# Altium schematic sheet Top.SchDoc
size 420 x 297 mm; SheetNumber: 1; SheetTotal: 13
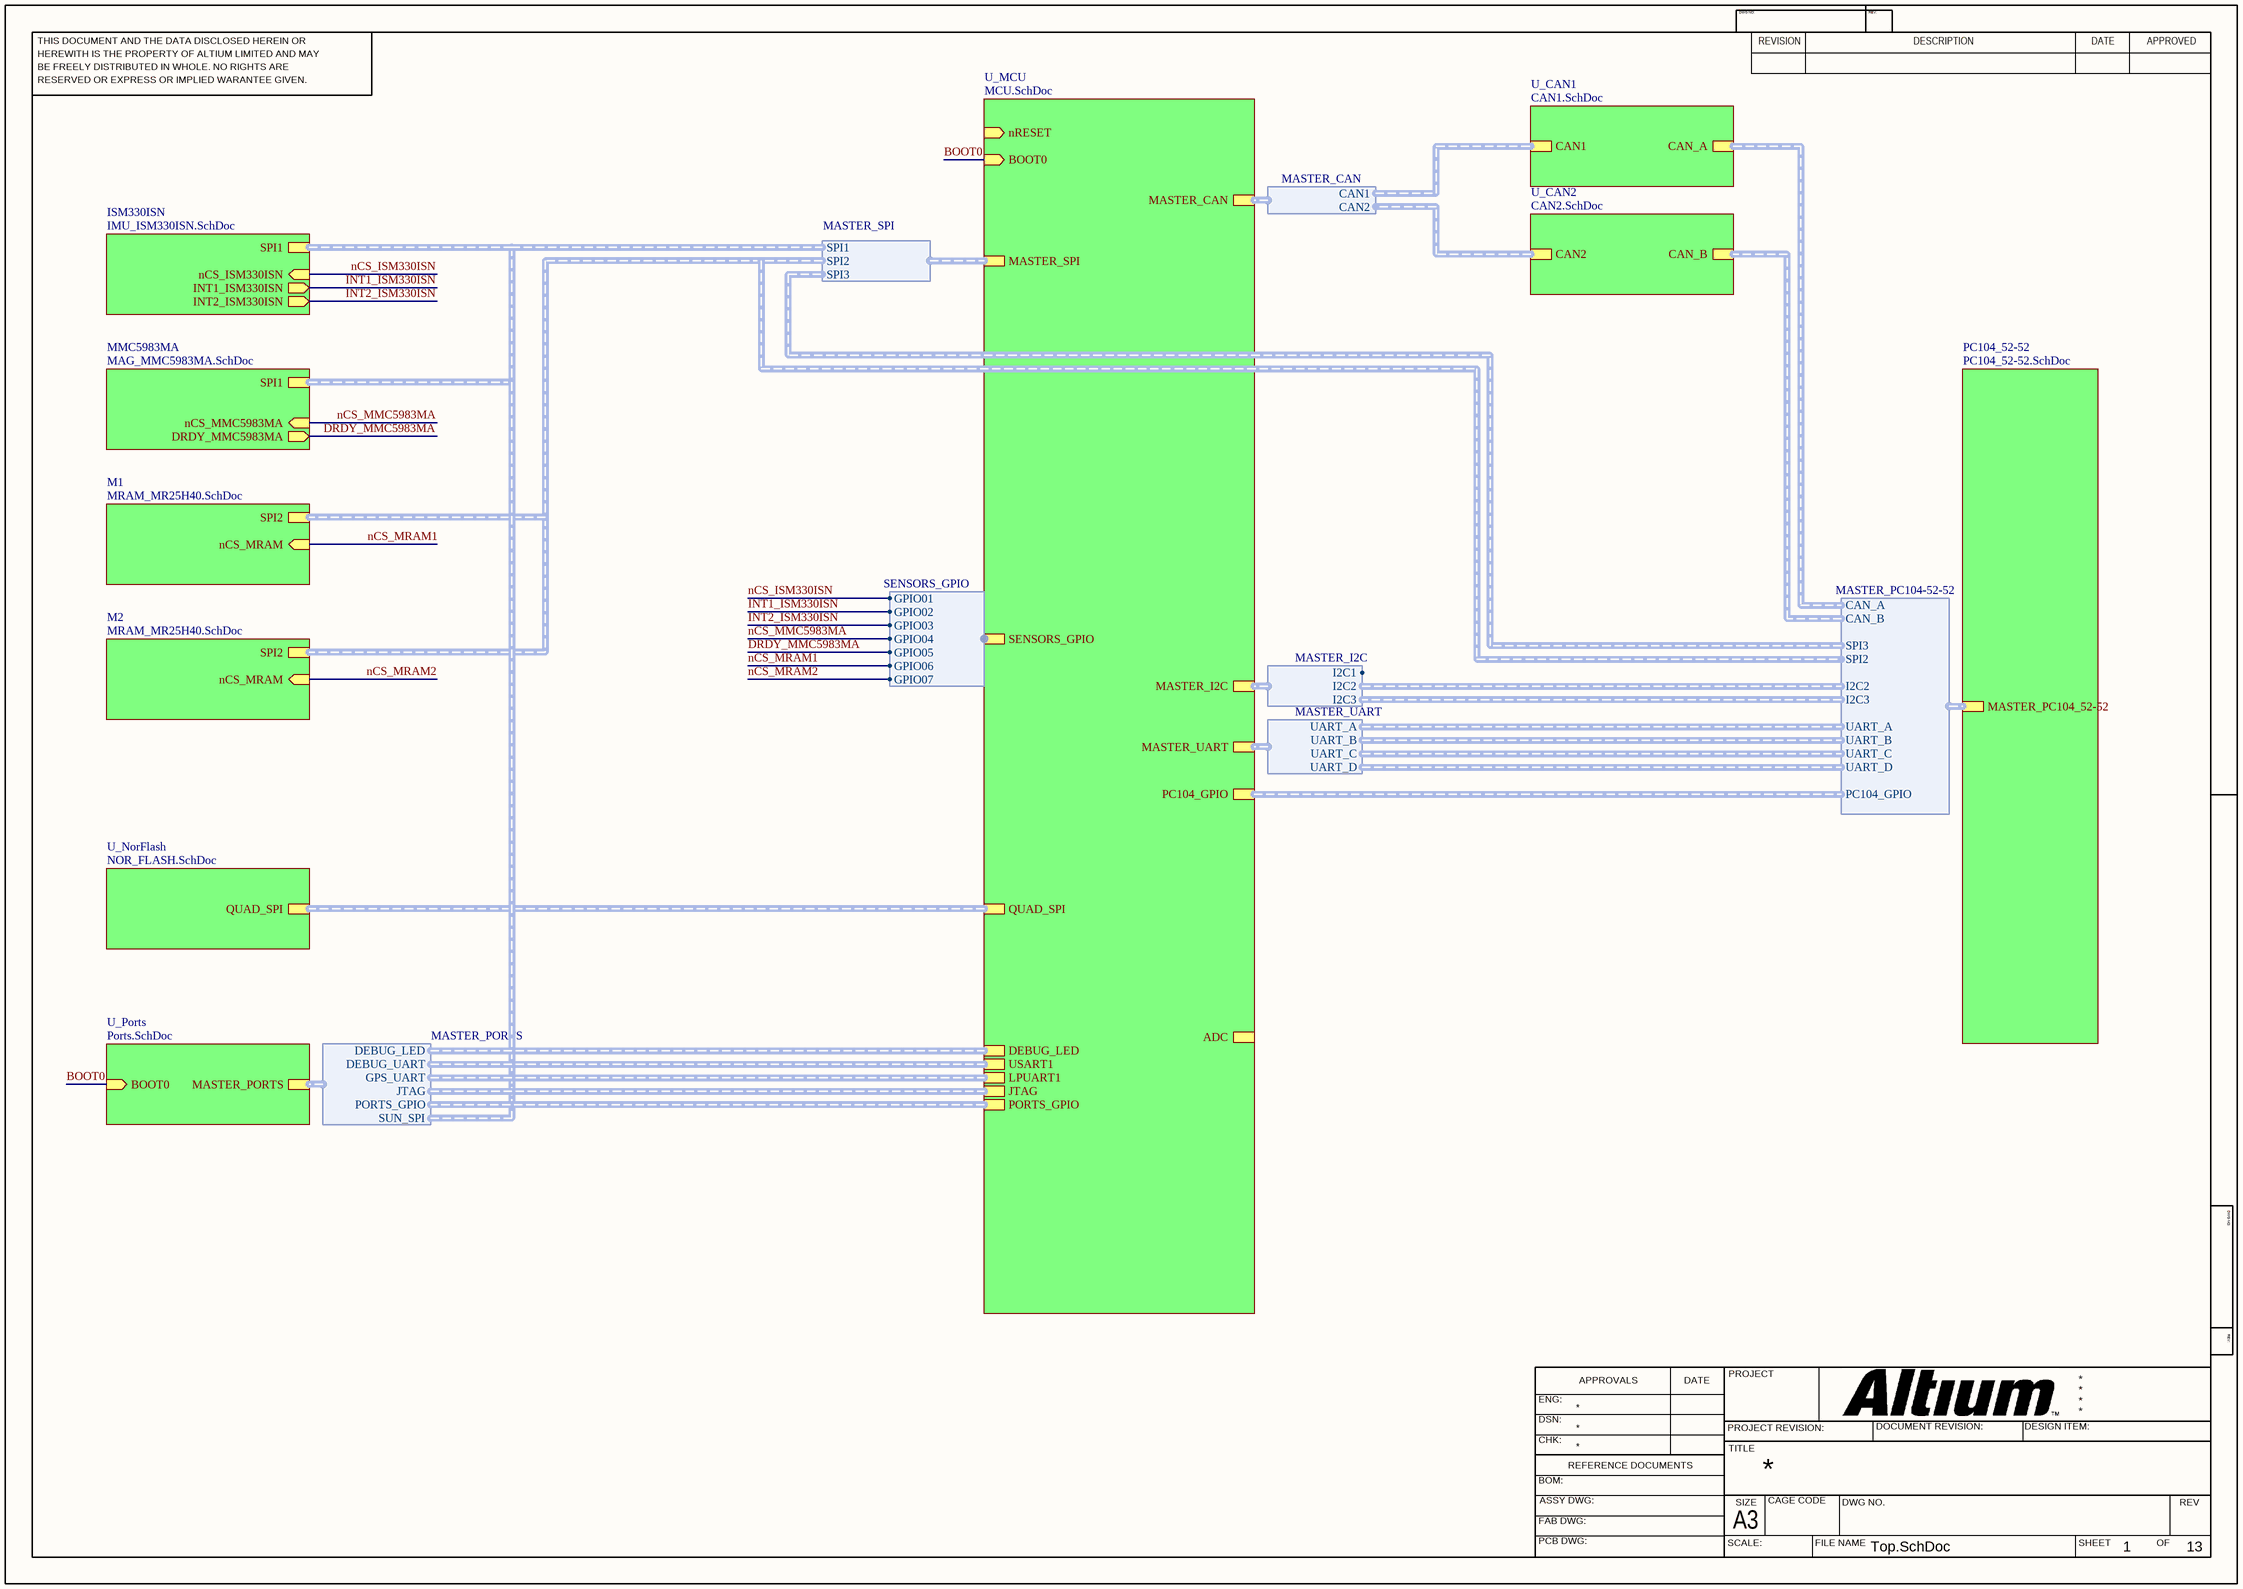
[diagram p0: Top.SchDoc]

## Sub-sheets
ISM330ISN = IMU_ISM330ISN.SchDoc: SPI1 (harness SPI1), nCS_ISM330ISN (in), INT1_ISM330ISN (out), INT2_ISM330ISN (out)
M1 = MRAM_MR25H40.SchDoc: nCS_MRAM (in), SPI2 (harness SPI2)
M2 = MRAM_MR25H40.SchDoc: nCS_MRAM (in), SPI2 (harness SPI2)
MMC5983MA = MAG_MMC5983MA.SchDoc: nCS_MMC5983MA (in), SPI1 (harness SPI1), DRDY_MMC5983MA (out)
PC104_52-52 = PC104_52-52.SchDoc: MASTER_PC104_52-52 (harness MASTER_PC104-52-52)
U_CAN1 = CAN1.SchDoc: CAN_A (harness CAN_A), CAN1 (harness CAN1)
U_CAN2 = CAN2.SchDoc: CAN_B (harness CAN_b), CAN2 (harness CAN2)
U_MCU = MCU.SchDoc: MASTER_I2C (harness MASTER_I2C), MASTER_SPI (harness MASTER_SPI), MASTER_UART (harness MASTER_UART), MASTER_CAN (harness MASTER_CAN), QUAD_SPI (harness QUAD_SPI), nRESET (in), BOOT0 (in), JTAG (harness JTAG), DEBUG_LED (harness DEBUG_LED), USART1 (harness USART1), ADC (harness ADC), LPUART1 (harness LPUART1), PC104_GPIO (harness PC104_GPIO), PORTS_GPIO (harness PORTS_GPIO), SENSORS_GPIO (harness SENSORS_GPIO)
U_NorFlash = NOR_FLASH.SchDoc: QUAD_SPI (harness QUAD_SPI)
U_Ports = Ports.SchDoc: MASTER_PORTS (harness MASTER_PORTS), BOOT0 (in)

## Harnesses
MASTER_SPI: SPI1, SPI2, SPI3
MASTER_CAN: CAN1, CAN2
MASTER_UART: UART_A, UART_B, UART_C, UART_D
MASTER_I2C: I2C2, I2C3, I2C1
SENSORS_GPIO: GPIO01, GPIO02, GPIO03, GPIO04, GPIO05, GPIO06, GPIO07
MASTER_PC104-52-52: CAN_A, CAN_B, I2C2, I2C3, PC104_GPIO, SPI2, SPI3, UART_A, UART_B, UART_C, UART_D
MASTER_PORTS: DEBUG_LED, DEBUG_UART, GPS_UART, JTAG, PORTS_GPIO, SUN_SPI

## Nets
BOOT0: sheet U_MCU/BOOT0, sheet U_Ports/BOOT0
DRDY_MMC5983MA: sheet MMC5983MA/DRDY_MMC5983MA, sheet U_MCU/SENSORS_GPIO.GPIO05
INT1_ISM330ISN: sheet ISM330ISN/INT1_ISM330ISN, sheet U_MCU/SENSORS_GPIO.GPIO02
INT2_ISM330ISN: sheet ISM330ISN/INT2_ISM330ISN, sheet U_MCU/SENSORS_GPIO.GPIO03
nCS_ISM330ISN: sheet ISM330ISN/nCS_ISM330ISN, sheet U_MCU/SENSORS_GPIO.GPIO01
nCS_MMC5983MA: sheet MMC5983MA/nCS_MMC5983MA, sheet U_MCU/SENSORS_GPIO.GPIO04
nCS_MRAM1: sheet M1/nCS_MRAM, sheet U_MCU/SENSORS_GPIO.GPIO06
nCS_MRAM2: sheet M2/nCS_MRAM, sheet U_MCU/SENSORS_GPIO.GPIO07

## Buses and harness runs
harness sheet ISM330ISN/SPI1 = sheet MMC5983MA/SPI1
harness sheet M1/SPI2 = sheet M2/SPI2
harness sheet U_MCU/QUAD_SPI = sheet U_NorFlash/QUAD_SPI

## Notes on the sheet
- THIS DOCUMENT AND THE DATA DISCLOSED HEREIN OR
- HEREWITH IS THE PROPERTY OF ALTIUM LIMITED AND MAY
- DWG NO:
- REVISION
- REV:
- DESCRIPTION
- DATE
- APPROVED
- BE FREELY DISTRIBUTED IN WHOLE. NO RIGHTS ARE
- RESERVED OR EXPRESS OR IMPLIED WARANTEE GIVEN.
- ENG:
- APPROVALS
- PROJECT
- DSN:
- CHK:
- REFERENCE DOCUMENTS
- PROJECT REVISION:
- TITLE
- DOCUMENT REVISION:
- DESIGN ITEM:
- BOM:
- FAB DWG:
- PCB DWG:
- ASSY DWG:
- SCALE:
- A3
- SIZE
- CAGE CODE
- FILE NAME
- DWG NO.
- SHEET
- OF
- REV